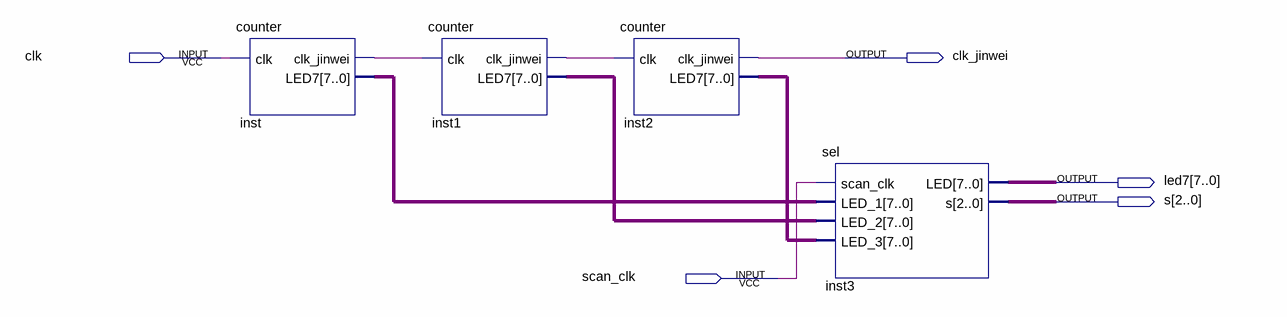
[diagram p0: schematic sheet]
// Quartus schematic counter_jin.bdf as structural Verilog: 4 symbols, 5 pins
module counter_jin (
  input  clk,
  input  scan_clk,
  output clk_jinwei,
  output [7:0] led7,
  output [2:0] s
);

  wire inst1_clk_jinwei, inst_clk_jinwei;
  wire [7:0] inst1_led7, inst2_led7, inst_led7;

  counter inst (.clk(clk), .clk_jinwei(inst_clk_jinwei), .LED7(inst_led7));
  counter inst1 (.clk(inst_clk_jinwei), .clk_jinwei(inst1_clk_jinwei), .LED7(inst1_led7));
  counter inst2 (.clk(inst1_clk_jinwei), .clk_jinwei(clk_jinwei), .LED7(inst2_led7));
  sel inst3 (.scan_clk(scan_clk), .LED_1(inst_led7), .LED_2(inst1_led7), .LED_3(inst2_led7), .LED(led7), .s(s));
endmodule
